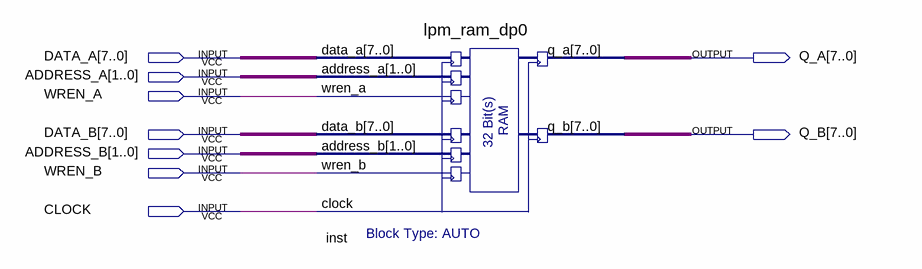
[diagram p0: schematic sheet]
// Quartus schematic registerfile.bdf as structural Verilog: 1 symbols, 9 pins
module registerfile (
  input  [7:0] DATA_A,
  input  [1:0] ADDRESS_A,
  input  WREN_A,
  input  [7:0] DATA_B,
  input  [1:0] ADDRESS_B,
  input  WREN_B,
  input  CLOCK,
  output [7:0] Q_A,
  output [7:0] Q_B
);

  lpm_ram_dp0 inst (
    .data_a(DATA_A), .address_a(ADDRESS_A), .wren_a(WREN_A), .data_b(DATA_B), .address_b(ADDRESS_B),
    .wren_b(WREN_B), .clock(CLOCK), .q_a(Q_A), .q_b(Q_B));
endmodule
